# Altium project dory-x.PrjPcb (part 3 of 12)
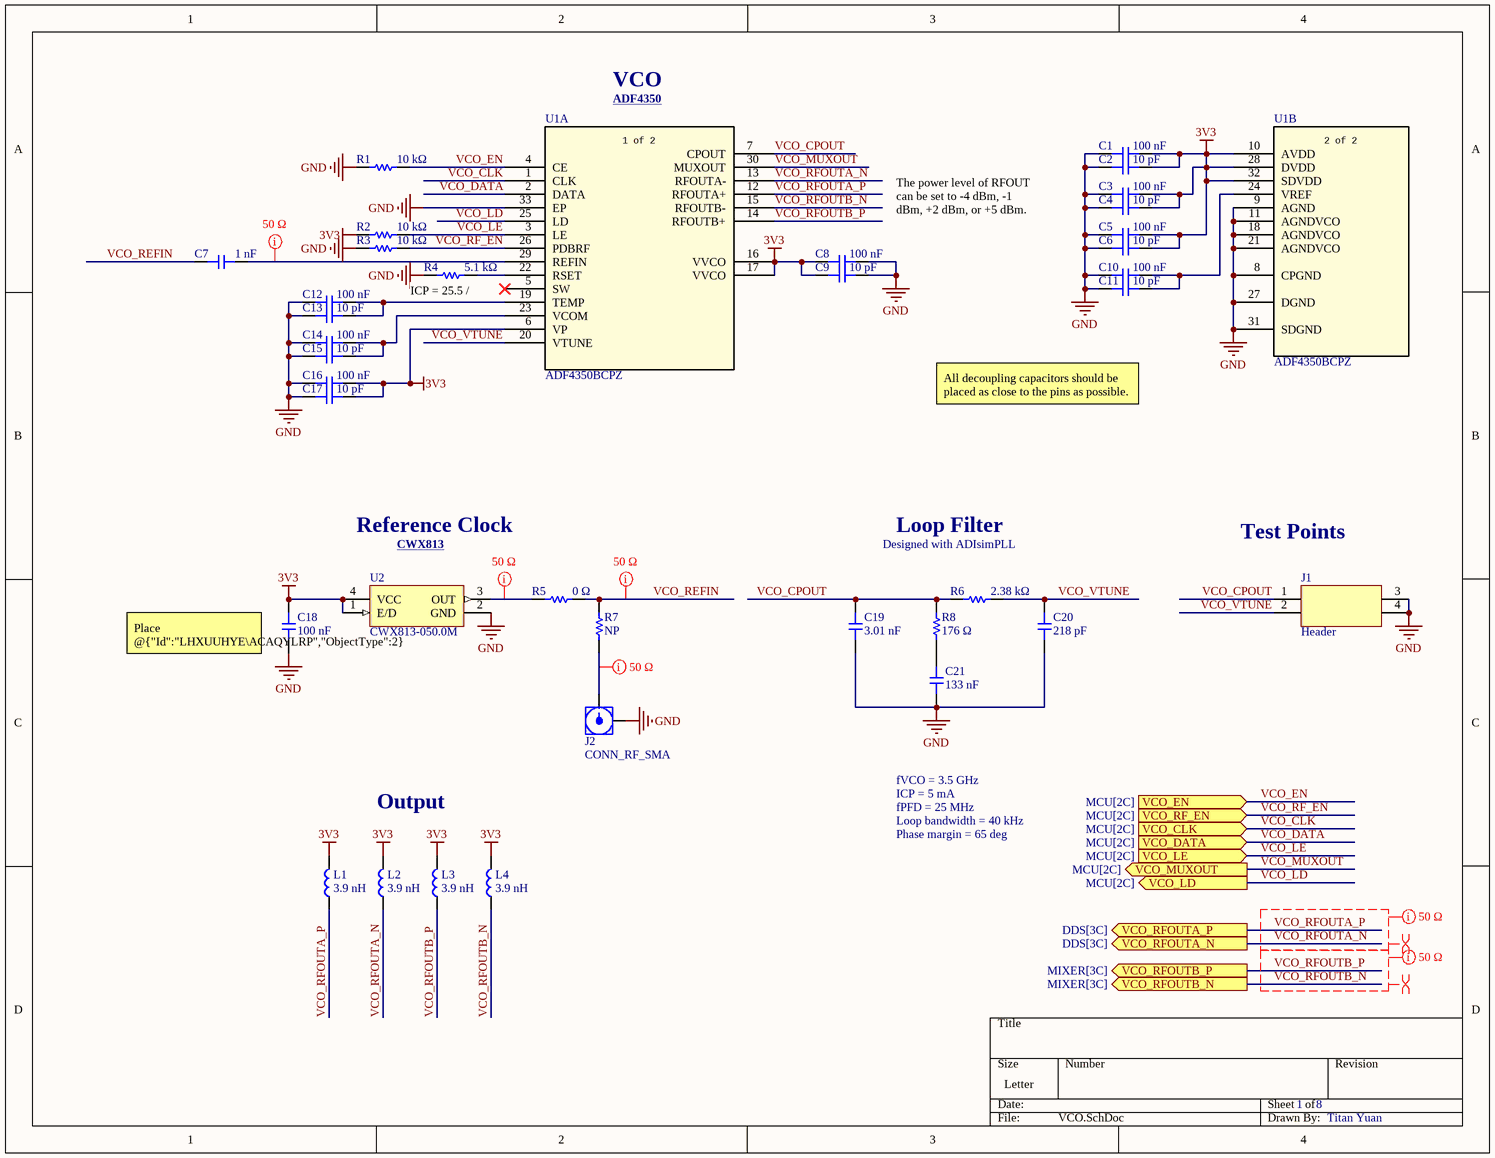
[diagram p9: VCO.SchDoc]

## Sheet VCO.SchDoc (continued)

### Library data of the parts (continued)
R4 = RES: 62.5mW Thick Film Resistors 50V ±100ppm/℃ ±1% 5.1kΩ 0402 Chip Resistor - Surface Mount ROHS; Manufacturer: Yageo; Manufacturer Part Number: RC0402FR-075K1L; Tolerance: +-1%; Power Rating: 1/16 W; Max Power Dissipation: 63mW; Temperature Coefficient: 100ppm/°C; Package Size: 0402; Supplier: DigiKey; Supplier Part Number: 311-5.10KLRCT-ND; RoHS: Compliant; Category: Chip SMD Resistors; Stock: 744508; Pricing: 1=0.1, 10=0.008, 25=0.0068, 50=0.005, 100=0.0046, 250=0.00328, 10000=0.00204, 20000=0.002, 30000=0.00196, 50000=0.00182, 70000=0.00181 (USD); Case/Package: 0402; Case Code (Imperial): 0402; China RoHS: Non-Compliant; Composition: Thick Film; Country of Origin: Mainland China, Taiwan; Depth: 500µm; Export Control Classification Number (ECCN) Code: EAR99; Features: Moisture Resistant; Height: 350µm; Harmonized Tariff Schedule (HTS) Code: 8533.21.00.30; Introduction Date: 2008-07-18; Lead Free: Lead Free; Length: 1mm; Lifecycle Status: Production; Max Operating Temperature: 155°C; Military Standard: Not; Min Operating Temperature: -55°C; Mounting Technology: Surface Mount; Pins: 2; Number of Terminals: 2; Number of Terminations: 2; Packaging: Cut Tape; Power Dissipation: 62.5mW; REACH SVHC: Yes; Value: 5.1kΩ; Schedule B: 8533210045, 8533210045|8533210045, 8533210045|8533210045|8533210045, 8533210045|8533210045|8533210045|8533210045; Termination: SMD/SMT; Voltage Rating: 50V; Voltage Rating (DC): 50V; Width: 500µm; Working Voltage: 50V; ComponentLink1URL: https://datasheet.octopart.com:443/RC0402FR-075K1L-Yageo-datasheet-175887523.pdf?src-supplier=IHS; ComponentLink1Description: https://datasheet.octopart.com:443/RC0402FR-075K1L-Yageo-datasheet-175887523.pdf?src-supplier=IHS; ComponentLink2URL: https://datasheet.octopart.com:443/RC0402FR-075K1L-Yageo-datasheet-103092701.pdf?src-supplier=Upverter; ComponentLink2Description: https://datasheet.octopart.com:443/RC0402FR-075K1L-Yageo-datasheet-103092701.pdf?src-supplier=Upverter; ComponentLink3URL: https://datasheet.octopart.com:443/RC0402FR-075K1L-Yageo-Group-datasheet-190305687.pdf?src-supplier=Future+Electronics; ComponentLink3Description: https://datasheet.octopart.com:443/RC0402FR-075K1L-Yageo-Group-datasheet-190305687.pdf?src-supplier=Future+Electronics; ComponentLink4URL: https://datasheet.octopart.com:443/RC0402FR-075K1L-Yageo-datasheet-164759695.pdf?src-supplier=Future+Electronics; ComponentLink4Description: https://datasheet.octopart.com:443/RC0402FR-075K1L-Yageo-datasheet-164759695.pdf?src-supplier=Future+Electronics; ComponentLink5URL: https://datasheet.octopart.com:443/RC0402FR-075K1L-Yageo-datasheet-137700087.pdf?src-supplier=Future+Electronics; ComponentLink5Description: https://datasheet.octopart.com:443/RC0402FR-075K1L-Yageo-datasheet-137700087.pdf?src-supplier=Future+Electronics; ComponentLink6URL: https://datasheet.octopart.com:443/RC0402FR-075K1L-Yageo-datasheet-12531192.pdf?src-supplier=Future+Electronics; ComponentLink6Description: https://datasheet.octopart.com:443/RC0402FR-075K1L-Yageo-datasheet-12531192.pdf?src-supplier=Future+Electronics; ComponentLink7URL: https://datasheet.octopart.com:443/RC0402FR-075K1L-Yageo-datasheet-505231.pdf?src-supplier=Future+Electronics; ComponentLink7Description: https://datasheet.octopart.com:443/RC0402FR-075K1L-Yageo-datasheet-505231.pdf?src-supplier=Future+Electronics; ComponentLink8URL: https://datasheet.octopart.com:443/RC0402FR-075K1L-Yageo-datasheet-10408619.pdf?src-supplier=Newark; ComponentLink8Description: https://datasheet.octopart.com:443/RC0402FR-075K1L-Yageo-datasheet-10408619.pdf?src-supplier=Newark; ComponentLink9URL: https://datasheet.octopart.com:443/RC0402FR-075K1L-Yageo-datasheet-8324527.pdf?src-supplier=Newark; ComponentLink9Description: https://datasheet.octopart.com:443/RC0402FR-075K1L-Yageo-datasheet-8324527.pdf?src-supplier=Newark; ComponentLink10URL: https://datasheet.octopart.com:443/RC0402FR-075K1L-Yageo-datasheet-62067350.pdf?src-supplier=element14+APAC; ComponentLink10Description: https://datasheet.octopart.com:443/RC0402FR-075K1L-Yageo-datasheet-62067350.pdf?src-supplier=element14+APAC; ComponentLink11URL: https://datasheet.octopart.com:443/RC0402FR-075K1L-Yageo-datasheet-148775077.pdf?src-supplier=TME; ComponentLink11Description: https://datasheet.octopart.com:443/RC0402FR-075K1L-Yageo-datasheet-148775077.pdf?src-supplier=TME; ComponentLink12URL: https://datasheet.octopart.com/RC0402FR-075K1L-Yageo-datasheet-73766026.pdf; ComponentLink12Description: https://datasheet.octopart.com/RC0402FR-075K1L-Yageo-datasheet-73766026.pdf; ComponentLink13URL: https://datasheet.octopart.com:443/RC0402FR-075K1L-Yageo-datasheet-8329306.pdf?src-supplier=element14; ComponentLink13Description: https://datasheet.octopart.com:443/RC0402FR-075K1L-Yageo-datasheet-8329306.pdf?src-supplier=element14; ComponentLink14URL: http://sigma.octopart.com:80/conflict_mineral_statement/Yageo-company-3.pdf?src-supplier=Compliance+Statements; ComponentLink14Description: http://sigma.octopart.com:80/conflict_mineral_statement/Yageo-company-3.pdf?src-supplier=Compliance+Statements; ComponentLink15URL: http://sigma.octopart.com:80/rohs_statement/Yageo-company-2.pdf?src-supplier=Compliance+Statements; ComponentLink15Description: http://sigma.octopart.com:80/rohs_statement/Yageo-company-2.pdf?src-supplier=Compliance+Statements
R5 = RES: GENERAL PURPOSE CHIP RESISTOR Metal Glaze/thick Film, 0.0625W, 0ohm, Surface Mount, 0402; Manufacturer: Yageo; Manufacturer Part Number: RC0402FR-070RL; Power Rating: 1/16 W; Power Dissipation: 62.5mW; Value: 0Ω; Voltage Rating: 50V; Tolerance: *; Package Size: 0402; Supplier: DigiKey; Supplier Part Number: 311-0.0LRCT-ND; RoHS: Compliant; Category: Chip SMD Resistors; Stock: 6847013; Pricing: 1=0.1, 10=0.010, 25=0.0064, 50=0.0054, 100=0.0047, 250=0.00392, 500=0.00346, 1000=0.00304, 5000=0.0023 (USD); Case/Package: 0402; Case Code (Imperial): 0402; Case Code (Metric): 1005; China RoHS: Non-Compliant; Composition: Thick Film; Contact Plating: Tin; Country of Origin: Mainland China, Taiwan; Export Control Classification Number (ECCN) Code: EAR99; Height: 350µm; Harmonized Tariff Schedule (HTS) Code: 8533.21.00.30; Introduction Date: 2004-09-22; Lead Free: Lead Free; Length: 1mm; Lifecycle Status: Production; Max Operating Temperature: 155°C; Min Operating Temperature: -55°C; Mounting Technology: Surface Mount; Number of Terminals: 2; Packaging: Tape & Reel; Radiation Hardening: No; REACH SVHC: Yes; Termination: SMD/SMT; Width: 500µm; ComponentLink1URL: https://datasheet.octopart.com:443/RC0402FR-070RL-Yageo-datasheet-141265859.pdf?src-supplier=Upverter; ComponentLink1Description: https://datasheet.octopart.com:443/RC0402FR-070RL-Yageo-datasheet-141265859.pdf?src-supplier=Upverter; ComponentLink2URL: https://sigma.octopart.com:443/138820526/technical_drawing/Yageo-RC0402FR-070RL.pdf?src-supplier=Upverter; ComponentLink2Description: https://sigma.octopart.com:443/138820526/technical_drawing/Yageo-RC0402FR-070RL.pdf?src-supplier=Upverter; ComponentLink3URL: https://datasheet.octopart.com:443/RC0402FR-070RL-Yageo-datasheet-12531192.pdf?src-supplier=IHS; ComponentLink3Description: https://datasheet.octopart.com:443/RC0402FR-070RL-Yageo-datasheet-12531192.pdf?src-supplier=IHS; ComponentLink4URL: https://datasheet.octopart.com:443/RC0402FR-070RL-Yageo-Group-datasheet-176638170.pdf?src-supplier=Future+Electronics; ComponentLink4Description: https://datasheet.octopart.com:443/RC0402FR-070RL-Yageo-Group-datasheet-176638170.pdf?src-supplier=Future+Electronics; ComponentLink5URL: https://datasheet.octopart.com:443/RC0402FR-070RL-Yageo-datasheet-164759695.pdf?src-supplier=Future+Electronics; ComponentLink5Description: https://datasheet.octopart.com:443/RC0402FR-070RL-Yageo-datasheet-164759695.pdf?src-supplier=Future+Electronics; ComponentLink6URL: https://datasheet.octopart.com:443/RC0402FR-070RL-Yageo-datasheet-137700087.pdf?src-supplier=Future+Electronics; ComponentLink6Description: https://datasheet.octopart.com:443/RC0402FR-070RL-Yageo-datasheet-137700087.pdf?src-supplier=Future+Electronics; ComponentLink7URL: https://datasheet.octopart.com:443/RC0402FR-070RL-Yageo-datasheet-10408619.pdf?src-supplier=Future+Electronics; ComponentLink7Description: https://datasheet.octopart.com:443/RC0402FR-070RL-Yageo-datasheet-10408619.pdf?src-supplier=Future+Electronics; ComponentLink8URL: https://datasheet.octopart.com:443/RC0402FR-070RL-Yageo-datasheet-8324527.pdf?src-supplier=Future+Electronics; ComponentLink8Description: https://datasheet.octopart.com:443/RC0402FR-070RL-Yageo-datasheet-8324527.pdf?src-supplier=Future+Electronics; ComponentLink9URL: https://datasheet.octopart.com:443/RC0402FR-070RL-Yageo-datasheet-79472498.pdf?src-supplier=Megastar; ComponentLink9Description: https://datasheet.octopart.com:443/RC0402FR-070RL-Yageo-datasheet-79472498.pdf?src-supplier=Megastar; ComponentLink10URL: https://datasheet.octopart.com/RC0402FR-070RL-Yageo-datasheet-73766026.pdf; ComponentLink10Description: https://datasheet.octopart.com/RC0402FR-070RL-Yageo-datasheet-73766026.pdf; ComponentLink11URL: http://sigma.octopart.com:80/conflict_mineral_statement/Yageo-company-3.pdf?src-supplier=Compliance+Statements; ComponentLink11Description: http://sigma.octopart.com:80/conflict_mineral_statement/Yageo-company-3.pdf?src-supplier=Compliance+Statements; ComponentLink12URL: http://sigma.octopart.com:80/rohs_statement/Yageo-company-2.pdf?src-supplier=Compliance+Statements; ComponentLink12Description: http://sigma.octopart.com:80/rohs_statement/Yageo-company-2.pdf?src-supplier=Compliance+Statements
R6 = RES: 100mW Thin Film Resistor ±25ppm/℃ ±0.1% 2.37kΩ 0603 Chip Resistor - Surface Mount ROHS; Manufacturer: Yageo; Manufacturer Part Number: RT0603BRD072K37L; Tolerance: +-0.1%; Power Rating: 1/10 W; Temperature Coefficient: 25ppm/°C; Voltage Rating: 75V; Voltage Rating (DC): 50V; Package Size: 0603; Supplier: DigiKey; Supplier Part Number: YAG4523CT-ND; RoHS: Compliant; Category: Chip SMD Resistors; Stock: 31067; Pricing: 1=0.1, 10=0.048, 25=0.0476, 50=0.047, 100=0.0468, 250=0.04432 (USD); Case/Package: 0603; Case Code (Imperial): 0603; China RoHS: Non-Compliant; Composition: Thin Film; Contact Plating: Tin; Country of Origin: Mainland China, Taiwan; Depth: 800µm; Export Control Classification Number (ECCN) Code: EAR99; Height: 450µm; Harmonized Tariff Schedule (HTS) Code: 8533.21.00.30; Introduction Date: 2008-06-09; Lead Free: Lead Free; Length: 1.6mm; Lifecycle Status: Production; Max Operating Temperature: 155°C; Military Standard: Not; Min Operating Temperature: -55°C; Mounting Technology: Surface Mount; Number of Terminals: 2; Power Dissipation: 100mW; Radiation Hardening: No; REACH SVHC: Yes; Value: 2.37kΩ; Termination: SMD/SMT; Width: 800µm; Working Voltage: 75V; ComponentLink1URL: https://datasheet.octopart.com:443/RT0603BRD072K37L-Yageo-datasheet-176402239.pdf?src-supplier=Future+Electronics; ComponentLink1Description: https://datasheet.octopart.com:443/RT0603BRD072K37L-Yageo-datasheet-176402239.pdf?src-supplier=Future+Electronics; ComponentLink2URL: https://datasheet.octopart.com:443/RT0603BRD072K37L-Yageo-datasheet-169971040.pdf?src-supplier=Future+Electronics; ComponentLink2Description: https://datasheet.octopart.com:443/RT0603BRD072K37L-Yageo-datasheet-169971040.pdf?src-supplier=Future+Electronics; ComponentLink3URL: https://datasheet.octopart.com:443/RT0603BRD072K37L-Yageo-datasheet-164439670.pdf?src-supplier=Future+Electronics; ComponentLink3Description: https://datasheet.octopart.com:443/RT0603BRD072K37L-Yageo-datasheet-164439670.pdf?src-supplier=Future+Electronics; ComponentLink4URL: https://datasheet.octopart.com:443/RT0603BRD072K37L-Yageo-datasheet-96443642.pdf?src-supplier=Upverter; ComponentLink4Description: https://datasheet.octopart.com:443/RT0603BRD072K37L-Yageo-datasheet-96443642.pdf?src-supplier=Upverter; ComponentLink5URL: https://datasheet.octopart.com/RT0603BRD072K37L-Yageo-datasheet-86813807.pdf; ComponentLink5Description: https://datasheet.octopart.com/RT0603BRD072K37L-Yageo-datasheet-86813807.pdf; ComponentLink6URL: http://sigma.octopart.com:80/conflict_mineral_statement/Yageo-company-3.pdf?src-supplier=Compliance+Statements; ComponentLink6Description: http://sigma.octopart.com:80/conflict_mineral_statement/Yageo-company-3.pdf?src-supplier=Compliance+Statements; ComponentLink7URL: http://sigma.octopart.com:80/rohs_statement/Yageo-company-2.pdf?src-supplier=Compliance+Statements; ComponentLink7Description: http://sigma.octopart.com:80/rohs_statement/Yageo-company-2.pdf?src-supplier=Compliance+Statements
R7 = RES: Resistor SMD Generic; Manufacturer: *; Manufacturer Part Number: *; Tolerance: *; Power Rating: *; Package Size: 0402
R8 = RES: Fixed Resistor, Thin Film, 0.1W, 174ohm, 75V, 0.1% +/-Tol, 25ppm/Cel, Surface Mount, 0603; Manufacturer: Yageo; Manufacturer Part Number: RT0603BRD07174RL; Tolerance: +-0.1%; Power Rating: 1/10 W; Max Power Dissipation: 100mW; Value: 174Ω; Temperature Coefficient: 25ppm/°C; Voltage Rating (DC): 50V; Package Size: 0603; Supplier: DigiKey; Supplier Part Number: 13-RT0603BRD07174RLCT-ND; RoHS: Compliant; Category: Chip SMD Resistors; Stock: 6832; Pricing: 1=0.13, 10=0.05, 25=0.0496, 50=0.049, 100=0.0469, 250=0.04592, 500=0.04432 (USD); Case/Package: 0603; Case Code (Imperial): 0603; China RoHS: Non-Compliant; Composition: Thin Film; Country of Origin: Mainland China, Taiwan; Export Control Classification Number (ECCN) Code: EAR99; Height: 450µm; Harmonized Tariff Schedule (HTS) Code: 8533.21.00.30; Introduction Date: 2008-06-09; Lead Free: Lead Free; Length: 1.6mm; Lifecycle Status: Production; Max Operating Temperature: 155°C; Min Operating Temperature: -55°C; Mounting Technology: Surface Mount; Number of Terminals: 2; Number of Terminations: 2; Power Dissipation: 100mW; REACH SVHC: Yes; Termination: SMD/SMT; Voltage Rating: 75V; Weight: 2.012816mg; Width: 800µm; Working Voltage: 75V; ComponentLink1URL: https://datasheet.octopart.com:443/RT0603BRD07174RL-Yageo-datasheet-176402239.pdf?src-supplier=IHS; ComponentLink1Description: https://datasheet.octopart.com:443/RT0603BRD07174RL-Yageo-datasheet-176402239.pdf?src-supplier=IHS; ComponentLink2URL: https://datasheet.octopart.com:443/RT0603BRD07174RL-Yageo-datasheet-96443642.pdf?src-supplier=Upverter; ComponentLink2Description: https://datasheet.octopart.com:443/RT0603BRD07174RL-Yageo-datasheet-96443642.pdf?src-supplier=Upverter; ComponentLink3URL: https://datasheet.octopart.com/RT0603BRD07174RL-Yageo-datasheet-86813807.pdf; ComponentLink3Description: https://datasheet.octopart.com/RT0603BRD07174RL-Yageo-datasheet-86813807.pdf; ComponentLink4URL: http://sigma.octopart.com:80/conflict_mineral_statement/Yageo-company-3.pdf?src-supplier=Compliance+Statements; ComponentLink4Description: http://sigma.octopart.com:80/conflict_mineral_statement/Yageo-company-3.pdf?src-supplier=Compliance+Statements; ComponentLink5URL: http://sigma.octopart.com:80/rohs_statement/Yageo-company-2.pdf?src-supplier=Compliance+Statements; ComponentLink5Description: http://sigma.octopart.com:80/rohs_statement/Yageo-company-2.pdf?src-supplier=Compliance+Statements
U1 = ADF4350BCPZ: Clock Generator/Frequency Synthesizer /PLL; Manufacturer_Name: Analog Devices Inc; Manufacturer: Analog Devices; Manufacturer Lifecycle Status: PRODUCTION; Frequency: 4.4GHz; Input: CMOS; Interface: SPI; Max Supply Current: 110mA; Max Supply Voltage: 3.6V; Min Supply Voltage: 3V; Number of Circuits: 1; Operating Supply Voltage: 3.3V; PLL: Yes; Copyright: Copyright (C) 2026 Ultra Librarian. All rights reserved.; Manufacturer_Part_Number: ADF4350BCPZ; RefDes: RefDes; Type: Type; Supplier: DigiKey; Supplier Part Number: 505-ADF4350BCPZ-ND; Manufacturer Part Number: ADF4350BCPZ; RoHS: Compliant; Category: Clock Generators, PLLs, Frequency Synthesizers; Stock: 1019; Pricing: 1=19.03, 10=15.163, 60=13.479, 120=13.02358, 300=12.54283, 540=12.29357 (USD); Case/Package: LFCSP EP; Contact Plating: Tin; Height: 1mm; Lead Free: Contains Lead; Length: 5mm; Lifecycle Status: Production; Clock Frequency: 4.4GHz; Max Operating Temperature: 85°C; Min Operating Temperature: -40°C; Mounting Technology: Surface Mount; Nominal Supply Current: 110mA; Number of Elements: 1; Pins: 32; Operating Supply Current: 110mA; Radiation Hardening: No; REACH SVHC: No; Schedule B: 8542390000, 8542390000|8542390000, 8542390000|8542390000|8542390000, 8542390000|8542390000|8542390000|8542390000; Width: 5mm; ComponentLink1URL: https://datasheet.octopart.com:443/ADF4350BCPZ-Analog-Devices-datasheet-10205825.pdf?src-supplier=Upverter; ComponentLink1Description: https://datasheet.octopart.com:443/ADF4350BCPZ-Analog-Devices-datasheet-10205825.pdf?src-supplier=Upverter; ComponentLink2URL: https://octopart.com:443/opatz8j6/c1?t=udrQOUzfFkOAWyWAEA7cqyFayNhf2KNKKGDfYFMB6GZaSb9CZKSMEHKf7pCuHUxopdhw1hcC7xAdPkTKiAktXH3bJB1pk1Tul7797cYMBauL9PkUTbFj8mq-mjLrrAdHNf2Y0KXY0WQPa22DRj8jl23FaNl_jcqCZT16psWAl7DzDR0kRYgmIVr9bT9oCEFpgRusrPtEnwiqB-UmKCaV5AkWG1Bgv3f-zQuBw2SdvHWw7bMWWq1AvelNNHwf5yPLwLfdUVq50EJMqBgitIW62mqajRG5rOgmWsexFFQUC7lNNoJ3hOKsfQ&src-supplier=Analog+Devices; ComponentLink2Description: https://octopart.com:443/opatz8j6/c1?t=udrQOUzfFkOAWyWAEA7cqyFayNhf2KNKKGDfYFMB6GZaSb9CZKSMEHKf7pCuHUxopdhw1hcC7xAdPkTKiAktXH3bJB1pk1Tul7797cYMBauL9PkUTbFj8mq-mjLrrAdHNf2Y0KXY0WQPa22DRj8jl23FaNl_jcqCZT16psWAl7DzDR0kRYgmIVr9bT9oCEFpgRusrPtEnwiqB-UmKCaV5AkWG1Bgv3f-zQuBw2SdvHWw7bMWWq1AvelNNHwf5yPLwLfdUVq50EJMqBgitIW62mqajRG5rOgmWsexFFQUC7lNNoJ3hOKsfQ&src-supplier=Analog+Devices; ComponentLink3URL: https://datasheet.octopart.com:443/ADF4350BCPZ-Analog-Devices-datasheet-101563323.pdf?src-supplier=Augswan; ComponentLink3Description: https://datasheet.octopart.com:443/ADF4350BCPZ-Analog-Devices-datasheet-101563323.pdf?src-supplier=Augswan; ComponentLink4URL: https://datasheet.octopart.com:443/ADF4350BCPZ-Analog-Devices-datasheet-14078374.pdf?src-supplier=iiiC; ComponentLink4Description: https://datasheet.octopart.com:443/ADF4350BCPZ-Analog-Devices-datasheet-14078374.pdf?src-supplier=iiiC; ComponentLink5URL: http://sigma.octopart.com:80/conflict_mineral_statement/Analog-Devices-company-33.pdf?src-supplier=Compliance+Statements; ComponentLink5Description: http://sigma.octopart.com:80/conflict_mineral_statement/Analog-Devices-company-33.pdf?src-supplier=Compliance+Statements; ComponentLink6URL: https://octopart.com:443/opatz8j6/c1?t=hO5EnkGswmsQRyLGLQUkgpU6XZJ4oAHGDbJsaZ-cnkWEcwnXR2khUFliKBOdHfKJHDj_7fYDDMlN9indiUDA61SujkT4A-IrrTLapyjxUMXVYBI2Njs-S5Bsgu0QoUfOKEuGx9uN4F5Tm9Vv1UtT9wuQfsN1oPSQ-QVDKYRMRdQuDXhVKSc4QVVyJsQ5hZZ8QujgyYB3AFq3lZDEZWAzoRqumeJreF-_0GYsVeeCsxZ0MdFP1epUicUX-Jrxjyb0gPoN6PCy9QbdXqe6zvs8NiU2r4fzKarPe-jEPhSgDPozoJAIcHNTxQ&src-supplier=Compliance+Statements; ComponentLink6Description: https://octopart.com:443/opatz8j6/c1?t=hO5EnkGswmsQRyLGLQUkgpU6XZJ4oAHGDbJsaZ-cnkWEcwnXR2khUFliKBOdHfKJHDj_7fYDDMlN9indiUDA61SujkT4A-IrrTLapyjxUMXVYBI2Njs-S5Bsgu0QoUfOKEuGx9uN4F5Tm9Vv1UtT9wuQfsN1oPSQ-QVDKYRMRdQuDXhVKSc4QVVyJsQ5hZZ8QujgyYB3AFq3lZDEZWAzoRqumeJreF-_0GYsVeeCsxZ0MdFP1epUicUX-Jrxjyb0gPoN6PCy9QbdXqe6zvs8NiU2r4fzKarPe-jEPhSgDPozoJAIcHNTxQ&src-supplier=Compliance+Statements
U2 = CWX813-050.0M: LVCMOS Output Clock Oscillator, 50MHz Nom; Manufacturer: Connor-Winfield; Frequency Stability: +-25 ppm; Supply Voltage: 3.3 V; Body Material: Ceramic; Fall Time: 6ns; Load Capacitance: 15pF; Max Supply Current: 30mA; Max Supply Voltage: 3.465V; Min Supply Voltage: 3.135V; Operating Supply Voltage: 3.3V; Manufacturer Part Number: CWX813-050.0M; Frequency: 50 MHz; Temperature Range: -20C to 70C; Supplier: DigiKey; Supplier Part Number: CW541CT-ND; RoHS: Compliant; Category: Oscillators; Stock: 2464; Pricing: 1=4.46, 10=3.878, 25=3.6668, 50=3.5152, 100=3.37, 250=3.28952 (USD); Case/Package: SMD/SMT; Height: 1.2954mm; Lead Free: Lead Free; Length: 7.0104mm; Lifecycle Status: Production; Max Operating Temperature: 70°C; Min Operating Temperature: -20°C; Mounting Technology: Surface Mount; Nominal Supply Current: 30mA; Number of Terminals: 4; Output Type: LVCMOS; REACH SVHC: Yes; Rise Time: 6ns; Width: 5.0038mm; ComponentLink1URL: https://datasheet.octopart.com:443/CWX813-050.0M-Connor-Winfield-datasheet-14434119.pdf?src-supplier=IHS; ComponentLink1Description: https://datasheet.octopart.com:443/CWX813-050.0M-Connor-Winfield-datasheet-14434119.pdf?src-supplier=IHS

## Sheet DDS.SchDoc
size Letter; DrawnBy: Titan Yuan; SheetNumber: 2; SheetTotal: 8
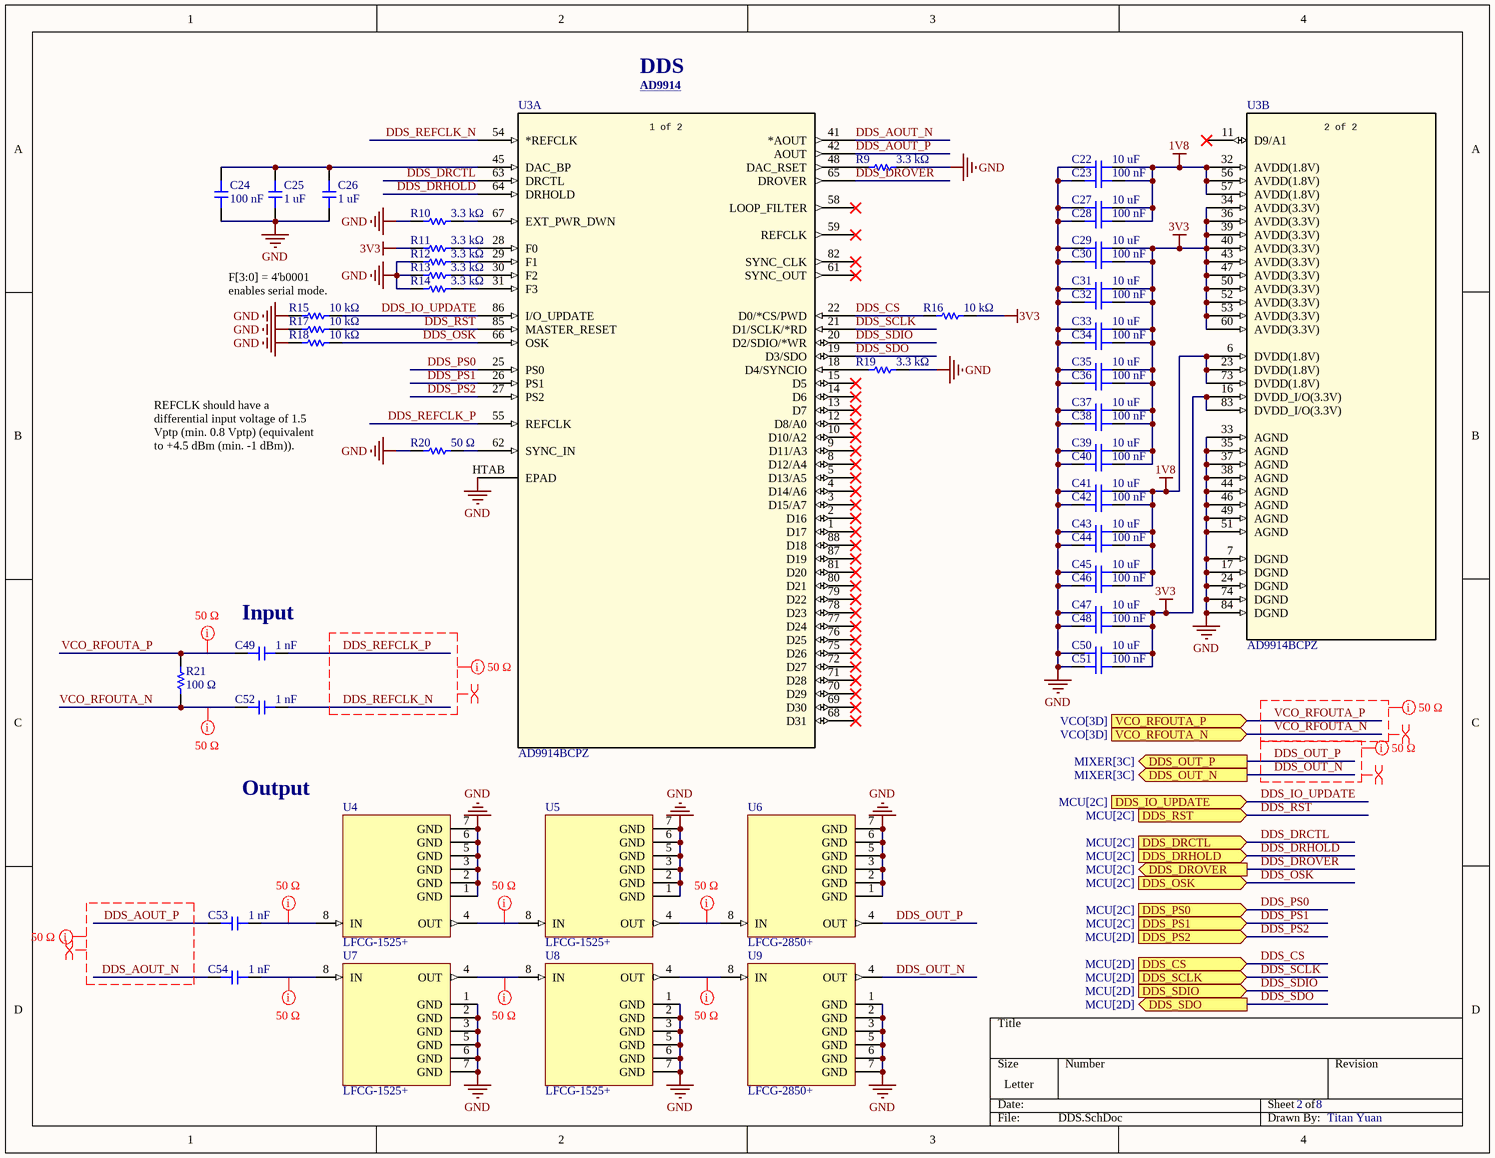
[diagram p1: DDS.SchDoc]

### Parts
C22  10 uF  [CAP_0805]
C23  100 nF  [CAP_0402]
C24  100 nF  [CAP_0402]
C25  1 uF  [CAP_0603]
C26  1 uF  [CAP_0603]
C27  10 uF  [CAP_0805]
C28  100 nF  [CAP_0402]
C29  10 uF  [CAP_0805]
C30  100 nF  [CAP_0402]
C31  10 uF  [CAP_0805]
C32  100 nF  [CAP_0402]
C33  10 uF  [CAP_0805]
C34  100 nF  [CAP_0402]
C35  10 uF  [CAP_0805]
C36  100 nF  [CAP_0402]
C37  10 uF  [CAP_0805]
C38  100 nF  [CAP_0402]
C39  10 uF  [CAP_0805]
C40  100 nF  [CAP_0402]
C41  10 uF  [CAP_0805]
C42  100 nF  [CAP_0402]
C43  10 uF  [CAP_0805]
C44  100 nF  [CAP_0402]
C45  10 uF  [CAP_0805]
C46  100 nF  [CAP_0402]
C47  10 uF  [CAP_0805]
C48  100 nF  [CAP_0402]
C49  1 nF  [CAP_0402]
C50  10 uF  [CAP_0805]
C51  100 nF  [CAP_0402]
C52  1 nF  [CAP_0402]
C53  1 nF  [CAP_0402]
C54  1 nF  [CAP_0402]
R9  3.3 kΩ  [RES_0402]
R10  3.3 kΩ  [RES_0402]
R11  3.3 kΩ  [RES_0402]
R12  3.3 kΩ  [RES_0402]
R13  3.3 kΩ  [RES_0402]
R14  3.3 kΩ  [RES_0402]
R15  10 kΩ  [RES_0402]
R16  10 kΩ  [RES_0402]
R17  10 kΩ  [RES_0402]
R18  10 kΩ  [RES_0402]
R19  3.3 kΩ  [RES_0402]
R20  50 Ω  [RES_0402]
R21  100 Ω  [RES_0402]
U3  AD9914BCPZ  [CP_88_5_ADI]  (parts A,B of 2)
U4  LFCG-1525+  [PL-429]
U5  LFCG-1525+  [PL-429]
U6  LFCG-2850+  [PL-429]
U7  LFCG-1525+  [PL-429]
U8  LFCG-1525+  [PL-429]
U9  LFCG-2850+  [PL-429]

### Ports
DDS_CS (in, see MCU[2D]), DDS_DRCTL (in, see MCU[2C]), DDS_DRHOLD (in, see MCU[2C]), DDS_DROVER (out, see MCU[2C]), DDS_IO_UPDATE (in, see MCU[2C]), DDS_OSK (in, see MCU[2C]), DDS_OUT_N (out, see MIXER[3C]), DDS_OUT_P (out, see MIXER[3C]), DDS_PS0 (in, see MCU[2C]), DDS_PS1 (in, see MCU[2C]), DDS_PS2 (in, see MCU[2D]), DDS_RST (in, see MCU[2C]), DDS_SCLK (in, see MCU[2D]), DDS_SDIO (in, see MCU[2D]), DDS_SDO (out, see MCU[2D]), VCO_RFOUTA_N (in, see VCO[3D]), VCO_RFOUTA_P (in, see VCO[3D])

### Nets
1V8: C22.2 C23.2 C27.2 C28.2 C41.2 C42.2 C43.2 C44.2 C45.2 C46.2 U3.6(DVDD(1.8V)) U3.23(DVDD(1.8V)) U3.32(AVDD(1.8V)) U3.56(AVDD(1.8V)) U3.57(AVDD(1.8V)) U3.73(DVDD(1.8V))
3V3: C29.2 C30.2 C31.2 C32.2 C33.2 C34.2 C35.2 C36.2 C37.2 C38.2 C39.2 C40.2 C47.2 C48.2 C50.2 C51.2 R11.2 R16.1 U3.16(DVDD_I/O(3.3V)) U3.34(AVDD(3.3V)) U3.36(AVDD(3.3V)) U3.39(AVDD(3.3V)) U3.40(AVDD(3.3V)) U3.43(AVDD(3.3V)) U3.47(AVDD(3.3V)) U3.50(AVDD(3.3V)) U3.52(AVDD(3.3V)) U3.53(AVDD(3.3V)) U3.60(AVDD(3.3V)) U3.83(DVDD_I/O(3.3V))
GND: C22.1 C23.1 C24.2 C25.2 C26.2 C27.1 C28.1 C29.1 C30.1 C31.1 C32.1 C33.1 C34.1 C35.1 C36.1 C37.1 C38.1 C39.1 C40.1 C41.1 C42.1 C43.1 C44.1 C45.1 C46.1 C47.1 C48.1 C50.1 C51.1 R9.1 R10.2 R12.2 R13.2 R14.2 R15.1 R17.1 R18.1 R19.1 R20.2 U3.7(DGND) U3.17(DGND) U3.24(DGND) U3.33(AGND) U3.35(AGND) U3.37(AGND) U3.38(AGND) U3.44(AGND) U3.46(AGND) U3.49(AGND) U3.51(AGND) U3.74(DGND) U3.84(DGND) U3.HTAB(EPAD) U4.1(GND) U4.2(GND) U4.3(GND) U4.5(GND) U4.6(GND) U4.7(GND) U5.1(GND) U5.2(GND) U5.3(GND) U5.5(GND) U5.6(GND) U5.7(GND) U6.1(GND) U6.2(GND) U6.3(GND) U6.5(GND) U6.6(GND) U6.7(GND) U7.1(GND) U7.2(GND) U7.3(GND) U7.5(GND) U7.6(GND) U7.7(GND) U8.1(GND) U8.2(GND) U8.3(GND) U8.5(GND) U8.6(GND) U8.7(GND) U9.1(GND) U9.2(GND) U9.3(GND) U9.5(GND) U9.6(GND) U9.7(GND)
DDS_AOUT_N: C54.2 U3.41(*AOUT)  [project net DDS_AOUT_N_2]
DDS_AOUT_P: C53.2 U3.42(AOUT)  [project net DDS_AOUT_P_2]
DDS_CS: R16.2 U3.22(D0/*CS/PWD) ; port DDS_CS
DDS_DRCTL: U3.63(DRCTL) ; port DDS_DRCTL
DDS_DRHOLD: U3.64(DRHOLD) ; port DDS_DRHOLD
DDS_DROVER: U3.65(DROVER) ; port DDS_DROVER
DDS_IO_UPDATE: R15.2 U3.86(I/O_UPDATE) ; port DDS_IO_UPDATE
DDS_OSK: R18.2 U3.66(OSK) ; port DDS_OSK
DDS_OUT_N: U9.4(OUT) ; port DDS_OUT_N
DDS_OUT_P: U6.4(OUT) ; port DDS_OUT_P
DDS_PS0: U3.25(PS0) ; port DDS_PS0
DDS_PS1: U3.26(PS1) ; port DDS_PS1
DDS_PS2: U3.27(PS2) ; port DDS_PS2
DDS_REFCLK_N: C52.1 U3.54(*REFCLK)  [project net DDS_REFCLK_N_2]
DDS_REFCLK_P: C49.1 U3.55(REFCLK)  [project net DDS_REFCLK_P_2]
DDS_RST: R17.2 U3.85(MASTER_RESET) ; port DDS_RST
DDS_SCLK: U3.21(D1/SCLK/*RD) ; port DDS_SCLK
DDS_SDIO: U3.20(D2/SDIO/*WR) ; port DDS_SDIO
DDS_SDO: U3.19(D3/SDO) ; port DDS_SDO
VCO_RFOUTA_N: C52.2 R21.1 ; port VCO_RFOUTA_N
VCO_RFOUTA_P: C49.2 R21.2 ; port VCO_RFOUTA_P
NetC24_1: C24.1 C25.1 C26.1 U3.45(DAC_BP)
NetC53_1: C53.1 U4.8(IN)
NetC54_1: C54.1 U7.8(IN)
NetR9_2: R9.2 U3.48(DAC_RSET)
NetR10_1: R10.1 U3.67(EXT_PWR_DWN)
NetR11_1: R11.1 U3.28(F0)
NetR12_1: R12.1 U3.29(F1)
NetR13_1: R13.1 U3.30(F2)
NetR14_1: R14.1 U3.31(F3)
NetR19_2: R19.2 U3.18(D4/SYNCIO)
NetR20_1: R20.1 U3.62(SYNC_IN)
NetU4_4: U4.4(OUT) U5.8(IN)
NetU5_4: U5.4(OUT) U6.8(IN)
NetU7_4: U7.4(OUT) U8.8(IN)
NetU8_4: U8.4(OUT) U9.8(IN)

Not connected (* = marked no-connect by the designer): U3 1(D17)* 2(D16)* 3(D15/A7)* 4(D14/A6)* 5(D13/A5)* 8(D12/A4)* 9(D11/A3)* 10(D10/A2)* 11(D9/A1)* 12(D8/A0)* 13(D7)* 14(D6)* 15(D5)* 58(LOOP_FILTER)* 59(REFCLK)* 61(SYNC_OUT)* 68(D31)* 69(D30)* 70(D29)* 71(D28)* 72(D27)* 75(D26)* 76(D25)* 77(D24)* 78(D23)* 79(D22)* 80(D21)* 81(D20)* 82(SYNC_CLK)* 87(D19)* 88(D18)*

### Layout directives
differential pair: DDS_AOUT_N, DDS_AOUT_P, DDS_OUT_N, DDS_OUT_P, DDS_REFCLK_N, DDS_REFCLK_P, VCO_RFOUTA_N, VCO_RFOUTA_P
net class 50 Ω: DDS_AOUT_N, DDS_AOUT_P, DDS_OUT_N, DDS_OUT_P, DDS_REFCLK_N, DDS_REFCLK_P, NetC53_1, NetC54_1, NetU4_4, NetU5_4, NetU7_4, NetU8_4, VCO_RFOUTA_N, VCO_RFOUTA_P

### Notes on the sheet
- DDS
- (near U3) AD9914 <https://www.analog.com/en/products/ad9914.html>
- F[3:0] = 4'b0001 enables serial mode.
- REFCLK should have a differential input voltage of 1.5 Vptp (min. 0.8 Vptp) (equivalent to +4.5 dBm (min. -1 dBm)).
- (near C49) Input
- Output
- (in symbol AD9914BCPZ, part A) 1 of 2
- (in symbol AD9914BCPZ, part B) 2 of 2